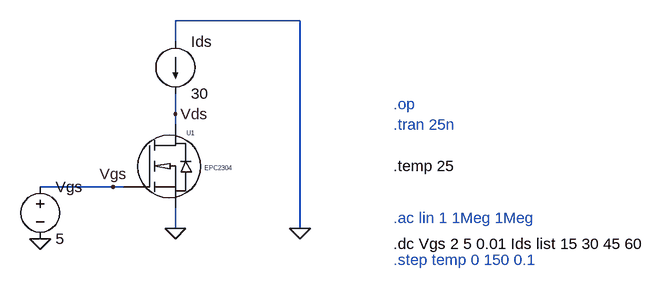
[diagram p0: schematic FET_model_validation.asc]
FET_model_validation.asc, the LTspice schematic file:
Version 4.1
SHEET 1 1060 680
WIRE 368 -64 176 -64
WIRE 176 -32 176 -64
WIRE 176 80 176 48
WIRE 176 96 176 80
WIRE 80 192 -32 192
WIRE 96 192 80 192
WIRE 176 256 176 224
WIRE 368 256 368 -64
FLAG 176 256 0
FLAG 176 80 Vds
FLAG 80 192 Vgs
FLAG 368 256 0
FLAG -32 272 0
SYMBOL EPCGaN 96 192 R0
SYMATTR InstName U1
SYMBOL current 176 -32 R0
WINDOW 123 0 0 Left 0
WINDOW 39 0 0 Left 0
SYMATTR InstName Ids
SYMATTR Value 30
SYMBOL voltage -32 176 R0
WINDOW 123 0 0 Left 0
WINDOW 39 0 0 Left 0
SYMATTR InstName Vgs
SYMATTR Value 5
TEXT 512 280 Left 2 !.dc Vgs 2 5 0.01 Ids list 15 30 45 60
TEXT 512 160 Left 2 !.temp 25
TEXT 512 304 Left 2 ;.step temp 0 150 0.1
TEXT 512 64 Left 2 ;.op
TEXT 512 240 Left 2 ;.ac lin 1 1Meg 1Meg
TEXT 512 96 Left 2 ;.tran 25n

The netlist it stands for:
* FET_model_validation.asc
X§U1 Vgs Vds 0 EPC2304  ; pins gatein drainin sourcein
Ids 0 Vds 30
Vgs Vgs 0 5
.dc Vgs 2 5 0.01 Ids list 15 30 45 60
.temp 25
* .step temp 0 150 0.1
* .op
* .ac lin 1 1Meg 1Meg
* .tran 25n
.lib EPCGanlibrary.lib
.backanno
.end